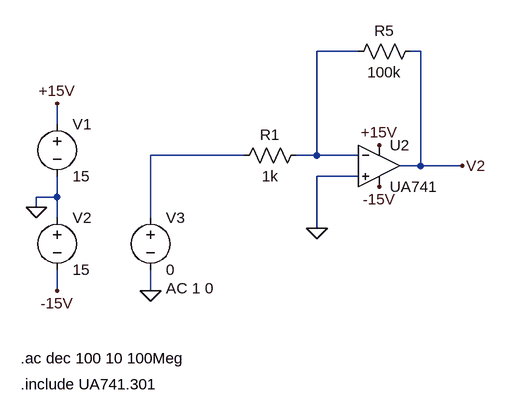
[diagram p0: schematic sim_ex2_g_100_non_invert.asc]
sim_ex2_g_100_non_invert.asc, the LTspice schematic file:
Version 4
SHEET 1 880 680
WIRE 208 -128 144 -128
WIRE 304 -128 288 -128
WIRE -256 -16 -256 -48
WIRE 32 32 -112 32
WIRE 144 32 144 -128
WIRE 144 32 112 32
WIRE 208 32 144 32
WIRE 304 48 304 -128
WIRE 304 48 272 48
WIRE 368 48 304 48
WIRE 208 64 144 64
WIRE -256 96 -256 64
WIRE -256 96 -288 96
WIRE -288 112 -288 96
WIRE -256 128 -256 96
WIRE -112 128 -112 32
WIRE 144 144 144 64
WIRE -256 240 -256 208
WIRE -112 240 -112 208
FLAG -288 112 0
FLAG -256 -48 +15V
FLAG -256 240 -15V
FLAG 240 16 +15V
FLAG 240 80 -15V
FLAG -112 240 0
FLAG 368 48 V2
FLAG 144 144 0
SYMBOL voltage -256 -32 R0
WINDOW 123 0 0 Left 0
WINDOW 39 0 0 Left 0
SYMATTR InstName V1
SYMATTR Value 15
SYMBOL voltage -256 112 R0
WINDOW 123 0 0 Left 0
WINDOW 39 0 0 Left 0
SYMATTR InstName V2
SYMATTR Value 15
SYMBOL res 304 -144 R90
WINDOW 0 0 56 VBottom 2
WINDOW 3 32 56 VTop 2
SYMATTR InstName R5
SYMATTR Value 100k
SYMBOL voltage -112 112 R0
WINDOW 123 24 124 Left 2
WINDOW 39 0 0 Left 0
SYMATTR Value2 AC 1 0
SYMATTR InstName V3
SYMATTR Value 0
SYMBOL OpAmps\\opamp2 240 -16 R0
SYMATTR InstName U2
SYMATTR Value UA741
SYMBOL res 128 16 R90
WINDOW 0 0 56 VBottom 2
WINDOW 3 32 56 VTop 2
SYMATTR InstName R1
SYMATTR Value 1k
TEXT -312 344 Left 2 !.ac dec 100 10 100Meg
TEXT -312 384 Left 2 !.include UA741.301

The netlist it stands for:
* sim_ex2_g_100_non_invert.asc
V1 +15V 0 15
V2 0 -15V 15
R5 V2 N001 100k
V3 N002 0 0 AC 1 0
XU2 0 N001 +15V -15V V2 UA741  ; pins In+ In- V+ V- OUT
R1 N001 N002 1k
.ac dec 100 10 100Meg
.include UA741.301
.backanno
.end